# EAGLE schematic daughter_compact (EAGLE 4.11)
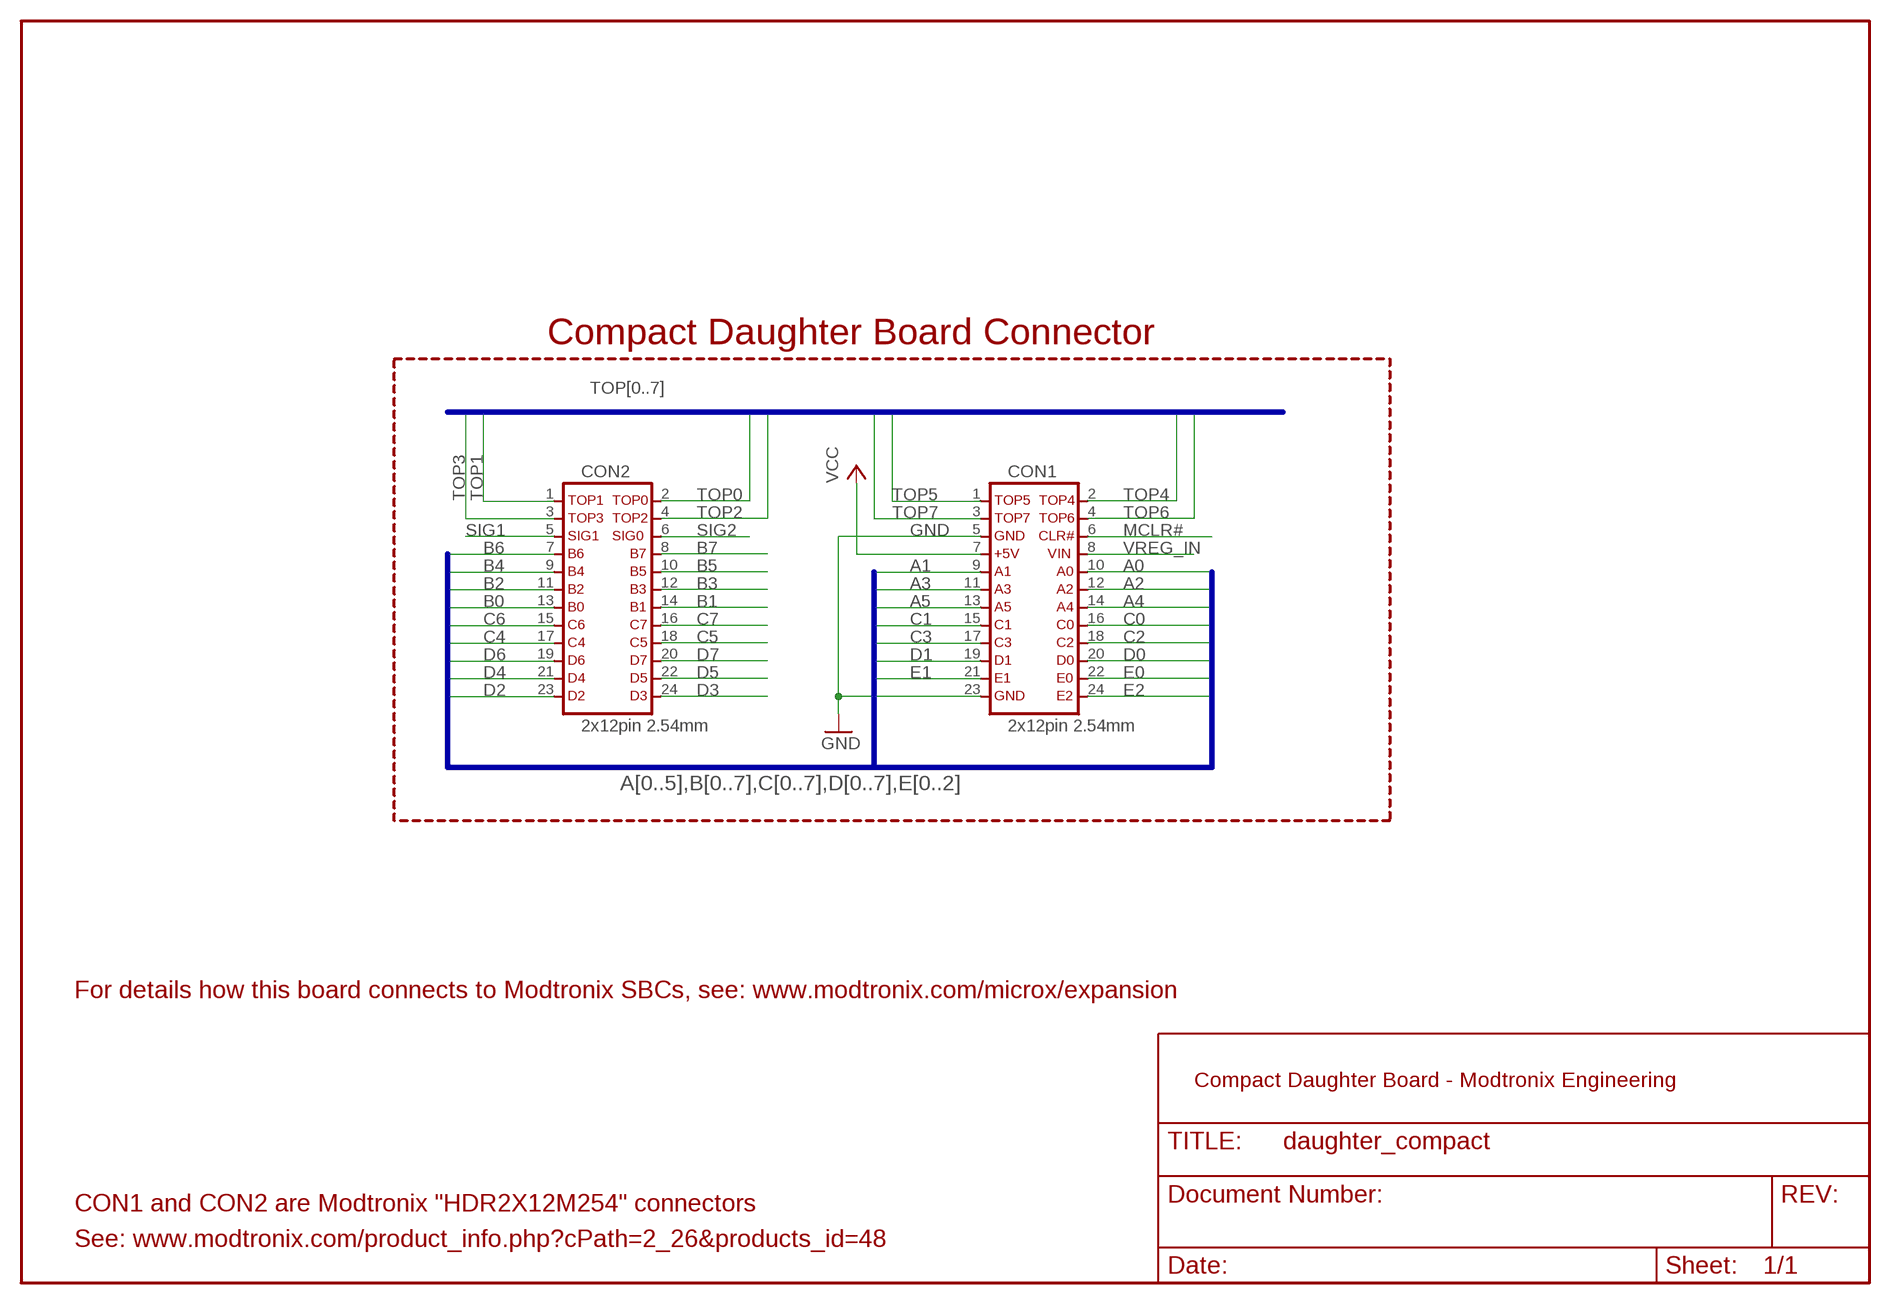
[diagram p0: schematic, sheet 1]

## Parts
CON1  2x12pin 2.54mm  CON24AM  [FE12-2]
CON2  2x12pin 2.54mm  CON24BM  [FE12-2]

## Nets
A0: CON1.10
A1: CON1.9
A2: CON1.12
A3: CON1.11
A4: CON1.14
A5: CON1.13
B0: CON2.13
B1: CON2.14
B2: CON2.11
B3: CON2.12
B4: CON2.9
B5: CON2.10
B6: CON2.7
B7: CON2.8
C0: CON1.16
C1: CON1.15
C2: CON1.18
C3: CON1.17
C4: CON2.17
C5: CON2.18
C6: CON2.15
C7: CON2.16
D0: CON1.20
D1: CON1.19
D2: CON2.23
D3: CON2.24
D4: CON2.21
D5: CON2.22
D6: CON2.19
D7: CON2.20
E0: CON1.22
E1: CON1.21
E2: CON1.24
GND [power]: CON1.5 CON1.23
MCLR#: CON1.6
SIG1: CON2.5
SIG2: CON2.6
TOP0: CON2.2
TOP1: CON2.1
TOP2: CON2.4
TOP3: CON2.3
TOP4: CON1.2
TOP5: CON1.1
TOP6: CON1.4
TOP7: CON1.3
VCC [power]: CON1.7
VREG_IN [power]: CON1.8

## Buses
A[0..5],B[0..7],C[0..7],D[0..7],E[0..2]
TOP[0..7]

## Notes on the sheet
- Compact Daughter Board Connector
- For details how this board connects to Modtronix SBCs, see: www.modtronix.com/microx/expansion
- Compact Daughter Board - Modtronix Engineering
- CON1 and CON2 are Modtronix "HDR2X12M254" connectors
- See: www.modtronix.com/product_info.php?cPath=2_26&products_id=48

## Library data of the parts
CON1 = david:CON24A
CON2 = david:CON24B

## Net classes
0 default: width 0.356 mm, clearance 0.711 mm
1 power: width 0.711 mm, clearance 0.711 mm